# EAGLE design haystack_rgb (EAGLE 9.1.0)
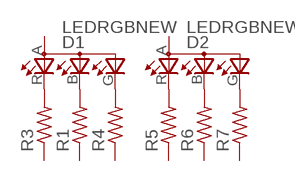
[diagram p0: schematic, sheet 1]

## Parts
D1  LEDRGBNEW  [P-LCC-4]
D2  LEDRGBNEW  [P-LCC-4]
R1  RES-US1206  [R1206]
R3  RES-US1206  [R1206]
R4  RES-US1206  [R1206]
R5  RES-US1206  [R1206]
R6  RES-US1206  [R1206]
R7  RES-US1206  [R1206]

## Nets
N$1: D1.B(CBLUE) R1.2
N$2: D1.R(CRED) R3.2
N$3: D1.G(CGREEN) R4.2
N$4: D2.R(CRED) R5.2
N$5: D2.B(CBLUE) R6.2
N$6: D2.G(CGREEN) R7.2
Unconnected: D1.A(A2) D2.A(A2) R1.1 R3.1 R4.1 R5.1 R6.1 R7.1

## Library data of the parts
D1 D2 = fab :LEDRGBNEW
R1 R3-R7 = fab :RES-US: Resistor (US Symbol) Variants with postfix FAB are widened to allow the routing of internal traces

## Board
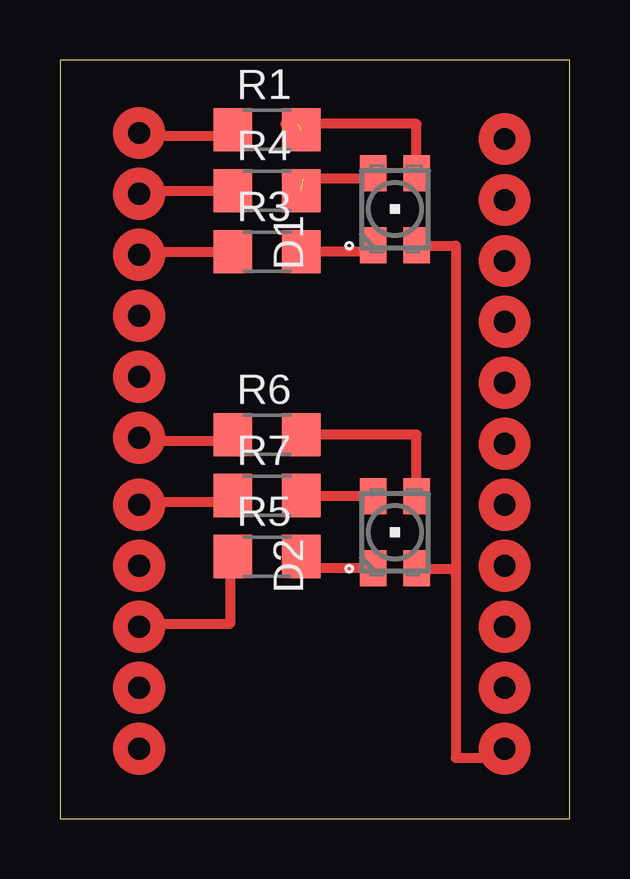
[diagram p1: board, top side]
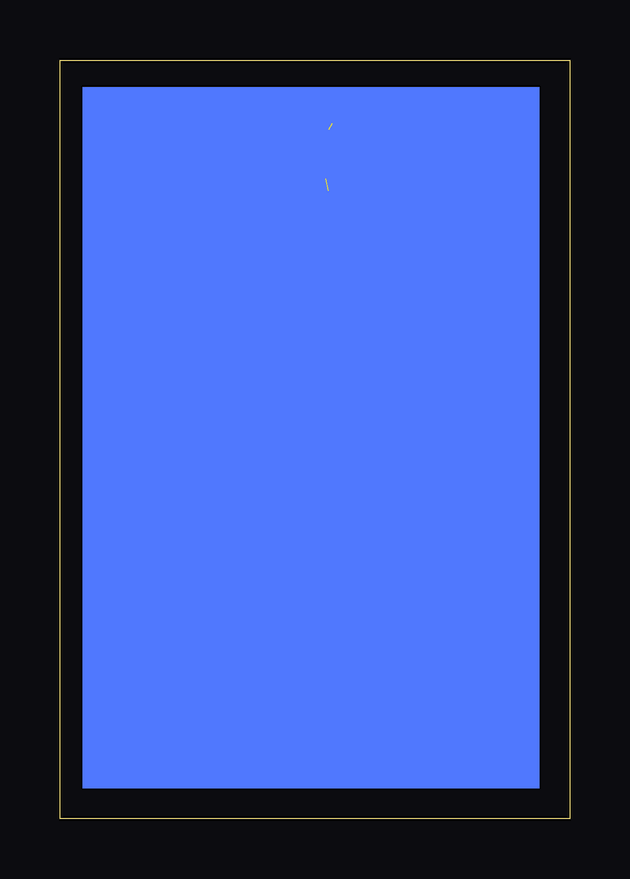
[diagram p2: board, bottom side, seen from below]

Size 21.26 x 31.61 mm. Coordinates in mm from the lower left corner, seen from the top.
Outline: 0,0 21.26,0 21.26,31.61 0,31.61 0,0
Copper layers (1*16): Top 0.035mm / dielectric 1.5mm / Bottom 0.035mm
Design rules "default": minimum track width 6mil, minimum drill 0.35mm, track to track 6mil, track to pad 6mil, pad to pad 6mil, via to via 6mil, smd to smd 6mil, copper to edge 40mil, drill to drill 6mil, minimum pad ring 10mil, minimum via ring 8mil, stop-mask expansion 4mil, vias tented up to drill 0mil, thermal gap 10mil

### Footprints (pad centres in the part's own frame; a part is rotated, then mirrored left to right if it is on the bottom)
P-LCC-4 = smd 1.1 x 1.5: A 0.902,-1.5; B 0.902,1.5; G -0.902,1.5; R -0.902,-1.5
R1206 = smd 1.6 x 1.803: 1 -1.422,0; 2 1.422,0

### Placement (x,y rotation side)
D1  13.97,25.4 0 top
D2  13.97,11.94 0 top
R1  8.64,28.7 0 top
R3  8.64,23.62 0 top
R4  8.64,26.16 0 top
R5  8.64,10.92 0 top
R6  8.64,16 0 top
R7  8.64,13.46 0 top

### Tracks (layer width: path | path; a pad name or v marks a point on that pad's centre or on a via)
N$1  (1 unrouted)
  Top 0.406: D1.B 14.87,28.96 9.91,28.96 9.4,28.96
N$2
  Top 0.406: D1.R 13.07,23.62 R3.2
N$3  (1 unrouted)
  Top 0.406: D1.G 13.07,26.67 10.16,26.67
N$4
  Top 0.406: D2.R 10.06,10.44 R5.2
N$5
  Top 0.406: D2.B 14.87,16 R6.2
N$6
  Top 0.406: D2.G 10.06,13.44 R7.2
N$7
  Top 0.406: 4.06,28.45 7.11,28.45 7.11,28.7
N$8
  Top 0.406: 4.06,25.91 4.06,26.16 7.62,26.16
N$9
  Top 0.406: 4.32,23.62 7.11,23.62
N$10
  Top 0.406: 4.32,8.13 7.11,8.13 7.11,10.67
N$11
  Top 0.406: 4.06,13.21 7.37,13.21 7.37,12.95
N$12
  Top 0.406: 4.06,16 4.06,15.75 7.37,15.75
N$13
  Top 0.406: 14.73,23.88 16.51,23.88 16.51,10.41 | 17.78,2.54 16.51,2.54 16.51,10.16 16.51,10.41 | 14.99,10.41 16.51,10.41
(copper drawn outside any net)
  shapes: Bottom area x1, Top circle x24